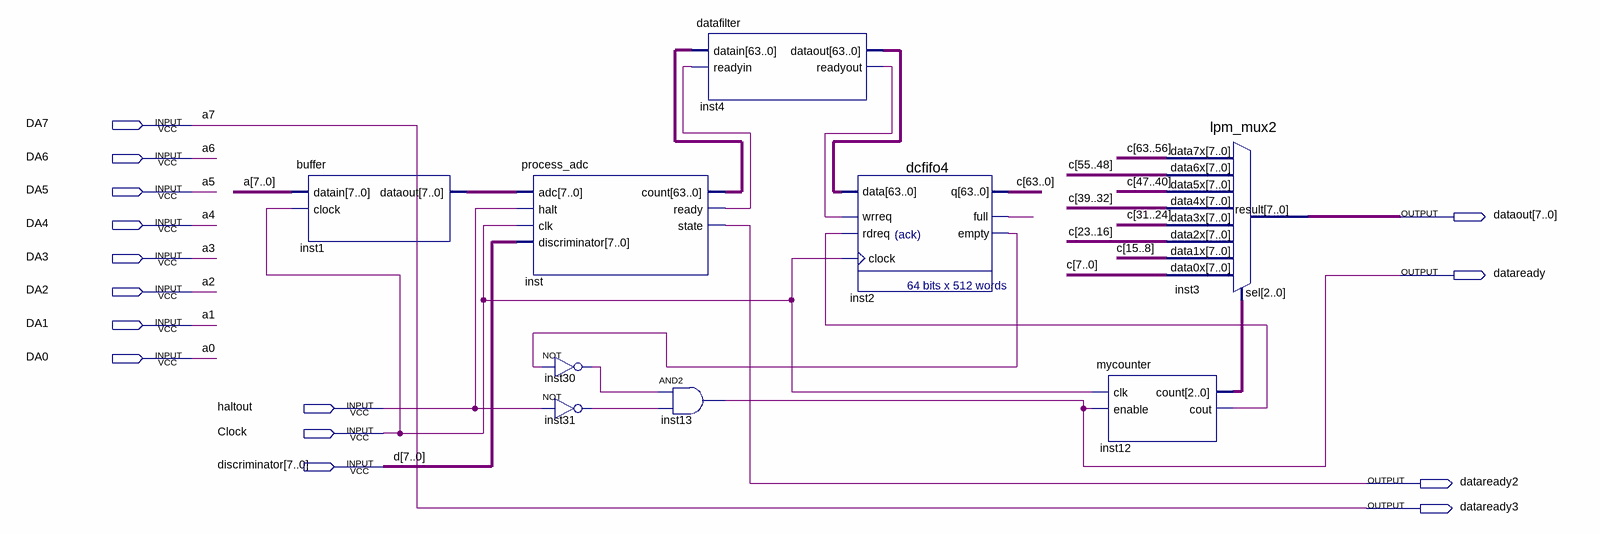
[diagram p0: schematic sheet]
// Quartus schematic flashy_talk.bdf as structural Verilog: 9 symbols, 15 pins
module flashy_talk (
  input  DA7,
  input  DA6,
  input  DA5,
  input  DA4,
  input  DA3,
  input  DA2,
  input  DA1,
  input  DA0,
  input  haltout,
  input  Clock,
  input  [7:0] discriminator,
  output [7:0] dataout,
  output dataready,
  output dataready2,
  output dataready3
);

  wire inst2_empty, inst2_full, inst4_readyout, inst12_cout, inst30_out, inst31_out, inst_ready;
  wire [2:0] inst12_count;
  wire [7:0] inst1_dataout;
  wire [63:0] c, inst4_dataout, inst_count;

  buffer inst1 (.datain({DA7, DA6, DA5, DA4, DA3, DA2, DA1, DA0}), .clock(Clock), .dataout(inst1_dataout));
  process_adc inst (
    .adc(inst1_dataout), .halt(haltout), .clk(Clock), .discriminator(discriminator), .count(inst_count),
    .ready(inst_ready), .state(dataready2));
  not inst30 (inst30_out, inst2_empty);
  not inst31 (inst31_out, haltout);
  and inst13 (dataready, inst30_out, inst31_out);
  datafilter inst4 (.datain(inst_count), .readyin(inst_ready), .dataout(inst4_dataout), .readyout(inst4_readyout));
  dcfifo4 inst2 (
    .data(inst4_dataout), .wrreq(inst4_readyout), .rdreq(inst12_cout), .clock(Clock), .q(c),
    .full(inst2_full), .empty(inst2_empty));
  mycounter inst12 (.clk(Clock), .enable(dataready), .count(inst12_count), .cout(inst12_cout));
  lpm_mux2 inst3 (
    .data7x(c[63:56]), .data6x(c[55:48]), .data5x(c[47:40]), .data4x(c[39:32]), .data3x(c[31:24]),
    .data2x(c[23:16]), .data1x(c[15:8]), .data0x(c[7:0]), .sel(inst12_count), .result(dataout));

  assign dataready3 = DA7;

  // Other names for the same wires on the sheet: a[7:0] = {DA7, DA6, DA5, DA4, DA3, DA2, DA1, DA0}; a0 = DA0;
  //   a1 = DA1; a2 = DA2; a3 = DA3; a4 = DA4; a5 = DA5; a6 = DA6; a7 = DA7; d[7:0] = discriminator
endmodule
